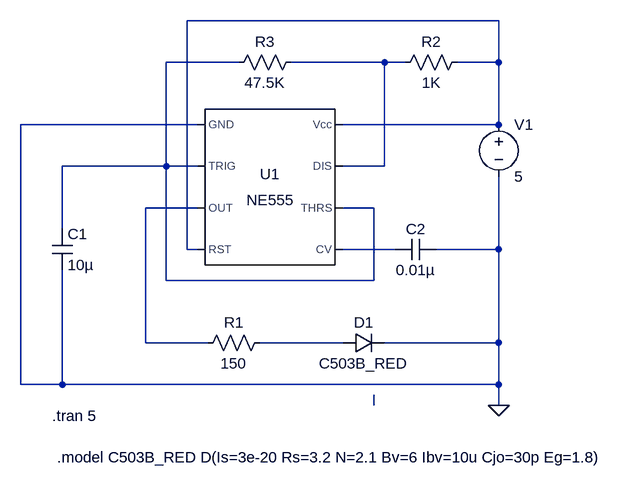
[diagram p0: schematic Relito_schematics.asc]
Relito_schematics.asc, the LTspice schematic file:
Version 4.1
SHEET 1 884 680
WIRE 640 -32 160 -32
WIRE 240 32 128 32
WIRE 464 32 320 32
WIRE 496 32 464 32
WIRE 640 32 640 -32
WIRE 640 32 576 32
WIRE 176 128 -96 128
WIRE 640 128 640 32
WIRE 640 128 400 128
WIRE 128 192 128 32
WIRE 128 192 -32 192
WIRE 176 192 128 192
WIRE 464 192 464 32
WIRE 464 192 400 192
WIRE 176 256 96 256
WIRE 448 256 400 256
WIRE -32 288 -32 192
WIRE 160 320 160 -32
WIRE 176 320 160 320
WIRE 480 320 400 320
WIRE 640 320 640 208
WIRE 640 320 544 320
WIRE 128 368 128 192
WIRE 448 368 448 256
WIRE 448 368 128 368
WIRE 96 464 96 256
WIRE 192 464 96 464
WIRE 400 464 272 464
WIRE 640 464 640 320
WIRE 640 464 464 464
WIRE -96 528 -96 128
WIRE -32 528 -32 352
WIRE -32 528 -96 528
WIRE 640 528 640 464
WIRE 640 528 -32 528
WIRE 448 560 448 544
WIRE 640 560 640 528
FLAG 640 560 0
SYMBOL Misc\\NE555 288 224 R0
SYMATTR InstName U1
SYMBOL voltage 640 112 R0
WINDOW 123 0 0 Left 0
WINDOW 39 0 0 Left 0
SYMATTR InstName V1
SYMATTR Value 5
SYMBOL res 176 480 R270
WINDOW 0 32 56 VTop 2
WINDOW 3 0 56 VBottom 2
SYMATTR InstName R1
SYMATTR Value 150
SYMATTR SpiceLine tol=1 pwr=0.1
SYMBOL res 592 16 R90
WINDOW 0 0 56 VBottom 2
WINDOW 3 32 56 VTop 2
SYMATTR InstName R2
SYMATTR Value 1K
SYMATTR SpiceLine tol=1 pwr=0.1
SYMBOL res 336 16 R90
WINDOW 0 0 56 VBottom 2
WINDOW 3 32 56 VTop 2
SYMATTR InstName R3
SYMATTR Value 47.5K
SYMATTR SpiceLine tol=1 pwr=0.1
SYMBOL cap -48 288 R0
WINDOW 3 24 56 Left 2
SYMATTR InstName C1
SYMATTR Value 10µ
SYMATTR Description Capacitor
SYMATTR Type cap
SYMATTR SpiceLine V=100 Irms=65m Rser=1.8 Lser=0 mfg="Nichicon" pn="UPR2A100MPH" type="Al electrolytic"
SYMBOL cap 544 304 R90
WINDOW 0 0 32 VBottom 2
WINDOW 3 32 32 VTop 2
SYMATTR InstName C2
SYMATTR Value 0.01µ
SYMATTR SpiceLine V=16 Irms=0 Rser=0 Lser=0 mfg="Murata" pn="GRM033R61C393KE84" type="X5R"
SYMBOL diode 400 480 R270
WINDOW 0 32 32 VTop 2
WINDOW 3 0 32 VBottom 2
SYMATTR InstName D1
SYMATTR Value C503B_RED
TEXT -48 576 Left 2 !.tran 5
TEXT -40 640 Left 2 !.model C503B_RED D(Is=3e-20 Rs=3.2 N=2.1 Bv=6 Ibv=10u Cjo=30p Eg=1.8)

The netlist it stands for:
* Relito_schematics.asc
X§U1 0 N002 N004 N001 N005 N002 N003 N001 NE555  ; pins GND TRIG OUT RST CV THRS DIS Vcc
V1 N001 0 5
R1 N004 N006 150 tol=1 pwr=0.1
R2 N001 N003 1K tol=1 pwr=0.1
R3 N003 N002 47.5K tol=1 pwr=0.1
C1 N002 0 10µ V=100 Irms=65m Rser=1.8 Lser=0 mfg="Nichicon" pn="UPR2A100MPH" type="Al electrolytic"
C2 0 N005 0.01µ V=16 Irms=0 Rser=0 Lser=0 mfg="Murata" pn="GRM033R61C393KE84" type="X5R"
D1 N006 0 C503B_RED
.model D D
.lib standard.dio
.tran 5
.model C503B_RED D(Is=3e-20 Rs=3.2 N=2.1 Bv=6 Ibv=10u Cjo=30p Eg=1.8)
.lib NE555.sub
.backanno
.end